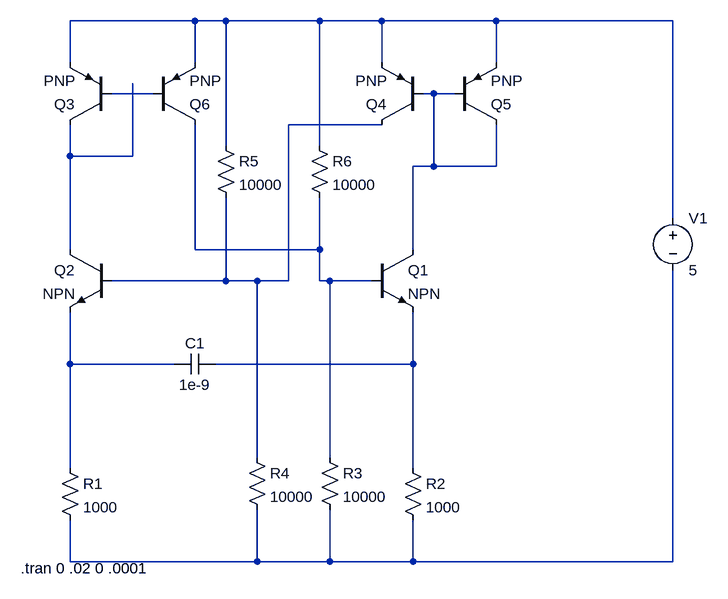
[diagram p0: schematic vco.asc]
vco.asc, the LTspice schematic file:
Version 4
SHEET 1 880 680
WIRE -64 -240 -256 -240
WIRE -16 -240 -64 -240
WIRE 128 -240 -16 -240
WIRE 224 -240 128 -240
WIRE 400 -240 224 -240
WIRE 672 -240 400 -240
WIRE -256 -176 -256 -240
WIRE -64 -176 -64 -240
WIRE 224 -176 224 -240
WIRE 400 -176 400 -240
WIRE -128 -128 -192 -128
WIRE 304 -128 288 -128
WIRE 336 -128 304 -128
WIRE 224 -80 80 -80
WIRE -16 -48 -16 -240
WIRE 128 -48 128 -240
WIRE -256 -32 -256 -80
WIRE -160 -32 -160 -144
WIRE -160 -32 -256 -32
WIRE 304 -16 304 -128
WIRE 304 -16 272 -16
WIRE 400 -16 400 -80
WIRE 400 -16 304 -16
WIRE 672 64 672 -240
WIRE -256 112 -256 -32
WIRE -64 112 -64 -80
WIRE 128 112 128 32
WIRE 128 112 -64 112
WIRE 272 112 272 -16
WIRE -16 160 -16 32
WIRE -16 160 -192 160
WIRE 32 160 -16 160
WIRE 80 160 80 -80
WIRE 80 160 32 160
WIRE 128 160 128 112
WIRE 144 160 128 160
WIRE 208 160 144 160
WIRE -256 288 -256 208
WIRE -96 288 -256 288
WIRE 272 288 272 208
WIRE 272 288 -32 288
WIRE 32 432 32 160
WIRE 144 432 144 160
WIRE -256 448 -256 288
WIRE 272 448 272 288
WIRE -256 592 -256 528
WIRE 32 592 32 512
WIRE 32 592 -256 592
WIRE 144 592 144 512
WIRE 144 592 32 592
WIRE 272 592 272 528
WIRE 272 592 144 592
WIRE 672 592 672 144
WIRE 672 592 272 592
SYMBOL npn 208 112 R0
SYMATTR InstName Q1
SYMBOL npn -192 112 M0
SYMATTR InstName Q2
SYMBOL pnp -192 -80 R180
SYMATTR InstName Q3
SYMBOL pnp 288 -80 R180
SYMATTR InstName Q4
SYMBOL pnp 336 -80 M180
SYMATTR InstName Q5
SYMBOL pnp -128 -80 M180
SYMATTR InstName Q6
SYMBOL cap -32 272 R90
WINDOW 0 0 32 VBottom 2
WINDOW 3 32 32 VTop 2
SYMATTR InstName C1
SYMATTR Value 1e-9
SYMBOL res -272 432 R0
SYMATTR InstName R1
SYMATTR Value 1000
SYMBOL res 256 432 R0
SYMATTR InstName R2
SYMATTR Value 1000
SYMBOL res 128 416 R0
SYMATTR InstName R3
SYMATTR Value 10000
SYMBOL res 16 416 R0
SYMATTR InstName R4
SYMATTR Value 10000
SYMBOL voltage 672 48 R0
WINDOW 123 0 0 Left 2
WINDOW 39 0 0 Left 2
SYMATTR InstName V1
SYMATTR Value 5
SYMBOL res -32 -64 R0
SYMATTR InstName R5
SYMATTR Value 10000
SYMBOL res 112 -64 R0
SYMATTR InstName R6
SYMATTR Value 10000
TEXT -332 602 Left 2 !.tran 0 .02 0 .0001

The netlist it stands for:
* vco.asc
Q1 N003 N006 N008 0 NPN
Q2 N005 N004 N007 0 NPN
Q3 N005 N002 N001 0 PNP
Q4 N004 N003 N001 0 PNP
Q5 N003 N003 N001 0 PNP
Q6 N006 N002 N001 0 PNP
C1 N008 N007 1e-9
R1 N007 N009 1000
R2 N008 N009 1000
R3 N006 N009 10000
R4 N004 N009 10000
V1 N001 N009 5
R5 N001 N004 10000
R6 N001 N006 10000
.model NPN NPN
.model PNP PNP
.lib standard.bjt
.tran 0 .02 0 .0001
.backanno
.end